# Altium schematic sheet dcdc_60v_12v.SchDoc
size A4; SheetNumber: 6; SheetTotal: 8; SPICEModelCacheOFSRASBJ: <root> / <DocumentId>OFSRASBJ</DocumentId> / <CacheFrame Number="0"> / <Model Name="tmk325b7226_m-pr" Kind="CKT"> / <Text>* TMK325B7226_M-PR     SPICE MODEL  ( General Type ) / *-------------------------------------------------------------------------------------------------------- / * Model Generated by TAIYO YUDEN Corporation (http://www.ty-top.com) / * Version 1.0 / * TAIYO YUDEN Control No. 170508_150330 / * Copyright(c) 2015 TAIYO YUDEN CO.,LTD. All Rights Reserved. / *-------------------------------------------------------------------------------------------------------- / * / * Products Name : Multilayer Ceramic Capacitors / * / * Characteristics : / *     Capacitance : 22 uF , Rated Voltage : 25V , TCC : X7R / *     Case Size : 3.2 x 2.5 / 0.126 x 0.098 [mm/inch] , Thickness : 2.5 / 0.098 [mm/inch] / *     (Conditions: Temperature = 25 degC , DC Bias Current/Voltage = 0A / 0V) / * / * Frequency Range : 40Hz - 3GHz / * / * External Node Assignments : / * / *  1  o---| |---o  2 / * / *-------------------------------------------------------------------------------------------------------- / .SubCkt TMK325B7226_M-PR 1 2 / **************************** / C0 1 110 20.232u / Cm 1 101 1.4192u / C1 101 102 0.46072u / Rc1 101 102 383.24 / C2 102 103 0.25707u / Rc2 102 103 27.255 / C3 103 110 0.063707u / Rc3 103 110 9.0927 / C2m 1 301 2.8514u / C21 301 302 4.5381u / Rc21 301 302 971.82 / C22 302 303 5.7922u / Rc22 302 303 294.55 / C23 303 304 5.617u / Rc23 303 304 301.8 / C24 304 305 2.3653u / Rc24 304 305 34.154 / C25 305 306 1.0031u / Rc25 305 306 28.966 / C26 306 307 0.1463u / Rc26 306 307 1.8028 / C27 307 308 0.26562u / Rc27 307 308 0.93359 / C28 308 309 0.29812u / Rc28 308 309 0.7461 / C29 309 110 3869.2p / Rc29 309 110 3.935 / Rp0 1 110 4.54545454545455Meg / L0 110 120 0.19079n / Lm 120 130 0.18902n / L1 120 121 0.21321n / RL1 121 130 0.13225 / L2 120 122 0.31017n / RL2 122 130 0.16258 / L3 120 123 1.2596n / RL3 123 130 144.01 / CR 120 124 3.8286u / LR 124 125 0.37731n / RR 125 130 10.878m / CL 130 140 3.0471p / LL 130 140 0.15642n / RL 130 140 11.971 / Rs 140 2 2.3557m / **************************** / .ends TMK325B7226_M-PR</Text> / </Model> / </CacheFrame> / </root>
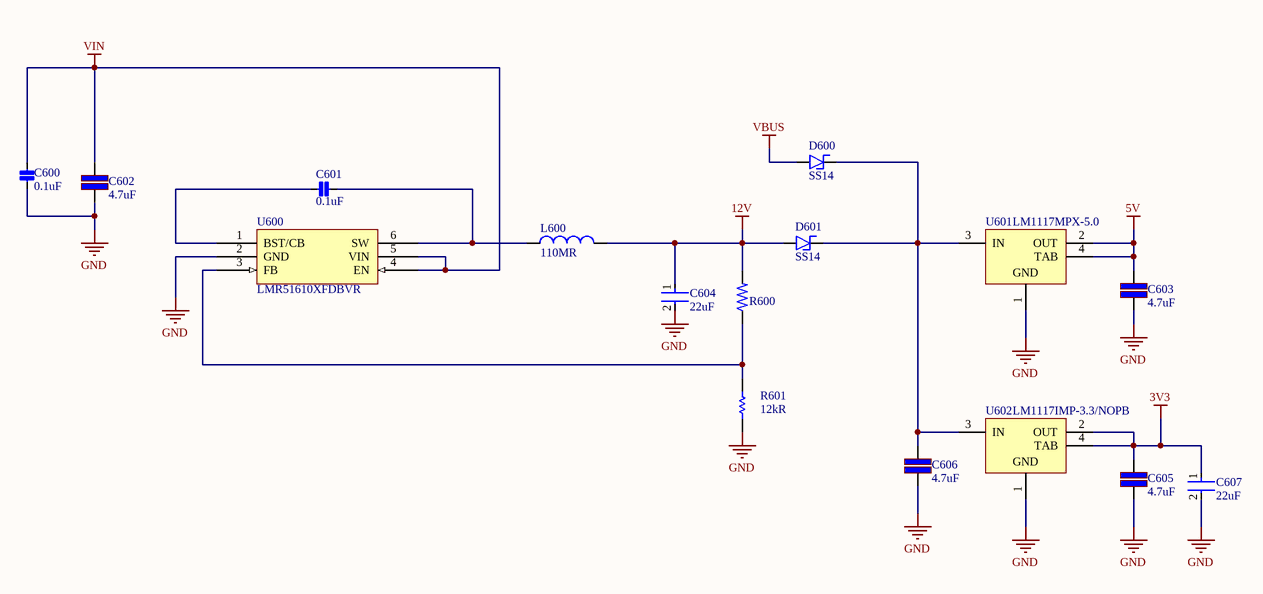
[diagram p0: dcdc_60v_12v.SchDoc]

## Parts
C600  value 0.1uF  [FP-CL10-IPC_B]  (hidden comment: CAP 0.1uF 50V X7R 0603)
C601  value 0.1uF  [FP-CL10-IPC_B]  (hidden comment: CAP 0.1uF 50V X7R 0603)
C602  value 4.7uF  [CAPC3225X20N]  (hidden comment: CAP 4.7uF 50V X7R 1210)
C603  value 4.7uF  [CAPC3225X20N]  (hidden comment: CAP 4.7uF 50V X7R 1210)
C604  value 22uF  [FP-1210-L_3_2_0_3-W_2_5_0-MFG]  (hidden comment: CAP 22uF 25V 1210 X7R)
C605  value 4.7uF  [CAPC3225X20N]  (hidden comment: CAP 4.7uF 50V X7R 1210)
C606  value 4.7uF  [CAPC3225X20N]  (hidden comment: CAP 4.7uF 50V X7R 1210)
C607  value 22uF  [FP-1210-L_3_2_0_3-W_2_5_0-MFG]  (hidden comment: CAP 22uF 25V 1210 X7R)
D600  SS14  [SMA]
D601  SS14  [SMA]
L600  value 110MR  [SRR1260-680M-Footprint-1]  (hidden comment: SRR1260-680M)
R600  100k 0603 1%  [RESC1608-IPC-LL]  (value not drawn)
R601  value 12kR  [RESC1608X55X25LL10T15]  (hidden comment: 12k 0603 1%)
U600  LMR51610XFDBVR  [SOT95P280X145-6N]
U601  LM1117MPX-5.0  [DCY0004A_M]
U602  LM1117IMP-3.3/NOPB  [DCY0004A_M]

## Nets
3V3: C605.2 C607.1 U602.2(OUT) U602.4(TAB)
5V: C603.2 U601.2(OUT) U601.4(TAB)
12V: C604.1 D601.A L600.2 R600.2
GND: C600.1 C602.1 C603.1 C604.2 C605.1 C606.1 C607.2 R601.1 U600.2(GND) U601.1(GND) U602.1(GND)
VBUS: D600.A
VIN: C600.2 C602.2 U600.4(EN) U600.5(VIN)
NetC601_1: C601.1 U600.1(BST/CB)
NetC601_2: C601.2 L600.1 U600.6(SW)
NetC606_2: C606.2 D600.K D601.K U601.3(IN) U602.3(IN)
NetR600_1: R600.1 R601.2 U600.3(FB)

## Notes on the sheet
- Title
- Size:
- Date:
- A4
- Number:
- Time:
- Revision:
- Sheet
- of
- github.com/blueacro
- blueacro.com
- CERN OHL v2.0
- Made available under the
- File:
- © 2024 StackFoundry LLC. All Rights Reserved.

## Library data of the parts
C600 C601 = CMP-001-00084-7: Cap Ceramic 0.1uF 50V X7R 20% SMD 0603 125C Paper T/R; Voltage: 50V
C602 C603 C605 C606 = CMP-001-00083-3: CAP CER 4.7UF 50V X7R 1210; Tolerance: 10%; Material: Ceramic; Voltage: 50V; Capacitance: 4.7uF; Width: 0.098inch; Height: 1.8mm; Depth: 2.5mm; Package Quantity: 1; Case/Package: 1210; Case Code (Imperial): 1210; Contact Plating: Tin; Thickness: 0.079inch; Radiation Hardening: No; Voltage Rating: 50V; Packaging: Tape and Reel; Lead Free: Lead Free; Dielectric: X7R; Min Operating Temperature: -55°C; Case Code (Metric): 3225; Max Operating Temperature: 125°C; Mount: Surface Mount; Length: 3.2mm
C604 C607 = CMP-001-00125-1: 1210 22 uF 25 V ±20% Tolerance X7R Multilayer Ceramic Chip Capacitor; Tolerance: 20%; Series: M; Max Operating Temperature: 125°C; Min Operating Temperature: -55°C; Case Code (Metric): 3225; Mounting Technology: Surface Mount; Case/Package: 1210; RoHS Compliant: Yes; Voltage Rating: 25V; Packaging: Tape and Reel; Case Code (Imperial): 1210
D600 D601 = CMP-080-0002-2: Source: diode.SCHLIB; Design Item ID: DIODE_SCHOTTKY
L600 = CMP-006-00034-1: Ind Power Shielded Wirewound 68uH 20% 100KHz 22Q-Factor Ferrite 2.1A T/R; Q Factor: 22; Self Resonant Frequency: 7.43MHz; Material: Steel; Current Rating: 2.1A; Height - Seated (Max): 0.256inch; Termination: SMD/SMT; Inductance Tolerance: 20%; Package Quantity: 600; Tolerance: 20%; Max DC Current: 2.1A; Reach SVHC Compliant: No; Min Operating Temperature: -40°C; Test Frequency: 100kHz; Depth: 12.8mm; Saturation Current: 2.1A; Length: 12.5mm; Width: 12.5mm; Case/Package: 1260; RMS Current (Irms): 2.1A; Frequency: 7.43MHz; Mounting Technology: Surface Mount; Packaging: Tape and Reel; Pins: 2; DC Current: 2.1A; Shielding: Shielded; Max Operating Temperature: 125°C; Sample Rate (Hz): 100kHz; DC Resistance (DCR): 110mR; Height: 6mm; RoHS Compliant: Yes; Series: SRR1260; Military Standard: Not; Core Material: Ferrite
R600 = CMP-009-00203-1: Res Thick Film 1.6 x 0.8 mm 100K Ohm 1% 0.1W(1/10W) 100ppm/ C Molded SMD Paper T/R
R601 = CMP-009-00236-1: SMD Chip Resistor, 12 kOhm, ± 1%, 100 mW, 0603 [1608 Metric], Thick Film, General Purpose; Voltage Rating: 50V; Temperature Coefficient: 100ppm/°C; Power Rating: 100mW; Number of Terminations: 2; Features: Moisture Resistant; Termination: SMD/SMT; Case Code (Imperial): 0603; Pins: 2; Case Code (Metric): 1608; Depth: 0.8mm; Reach SVHC Compliant: No; Packaging: Tape and Reel; Width: 0.8mm; Resistance Tolerance: 1%; Resistor Type: Thick Film; Min Operating Temperature: -55°C; Series: RC; RoHS Compliant: Yes; Case/Package: 0603; Length: 1.6mm; Voltage Rating (DC): 50V; Lead Free: Lead Free; Max Operating Temperature: 155°C; Max Power Dissipation: 100mW; Construction: Rectangular; Tolerance: 1%; Military Standard: Not
U600 = CMP-019-00077-1: SIMPLE SWITCHER® power converter with 4.5V-to-65V 1A synchronous buck and 25µA quiescent current 6-SOT-23 -40 to 150
U601 = CMP-019-00078-1: LDO Regulator Pos 5V 0.8A 4-Pin(3+Tab) SOT-223 T/R; Min Supply Voltage: 6.5V; Power Supply Rejection Ratio (PSRR): 75dB; Quiescent Current: 10mA; Dropout Voltage: 1.2V; Min Input Voltage: 2.6V; Output Current: 800mA; Number of Outputs: 1; Accuracy: 1%; Output Type: Fixed; Output Configuration: Positive; Max Supply Voltage: 15V; Current Rating: 800A; Case/Package: SOT-223; Min Operating Temperature: 0°C; Termination: SMD/SMT; Max Operating Temperature: 125°C; Reach SVHC Compliant: No; Lead Free: Contains Lead; Max Output current: 800mA; Mounting Technology: Surface Mount; Output Voltage: 5V; Packaging: Tape and Reel; Max Output Voltage: 5V; Max Supply Current: 10mA; Output Voltage Accuracy: 1%; Series: -; Pins: 4; Number of Regulators: 1; Polarity: Positive; RoHS Compliant: No
U602 = CMP-019-00080-1: LDO Regulator Pos 3.3V 0.8A 4-Pin(3+Tab) SOT-223 T/R / IC REG LDO 3.3V 0.8A SOT223; Quiescent Current: 15mA; Min Input Voltage: 2.6V; Max Output current: 800mA; Number of Channels: 1; Accuracy: 1%; Min Supply Voltage: 4.75V; Dropout Voltage: 1.2V; Polarity: Positive; Current Rating: 800A; Max Supply Voltage: 10V; Output Type: Fixed; Package Quantity: 1000; Termination: SMD/SMT; Pins: 4; Length: 6.5mm; Nominal Output Voltage: 3.3V; RoHS Compliant: Yes; Height: 1.6mm; Output Voltage Accuracy: 1%; Reach SVHC Compliant: No; Number of Outputs: 1; Lead Free: Lead Free; Min Current Limit: 800mA; Case/Package: SOT-223; Width: 3.56mm; Output Current: 800mA; Radiation Hardening: No; Thickness: 1.6mm; Packaging: Tape and Reel; Min Operating Temperature: -40°C; Number of Regulators: 1; Output Voltage: 3.3V; Max Operating Temperature: 125°C; Mounting Technology: Surface Mount